# Altium schematic sheet sensor_expansion.SchDoc: Extensibilité capteurs
size A4; DrawnBy: Pierre Dejean / Adam Alves; Revision: V0.1 Rev A; SheetNumber: 3; SheetTotal: 9
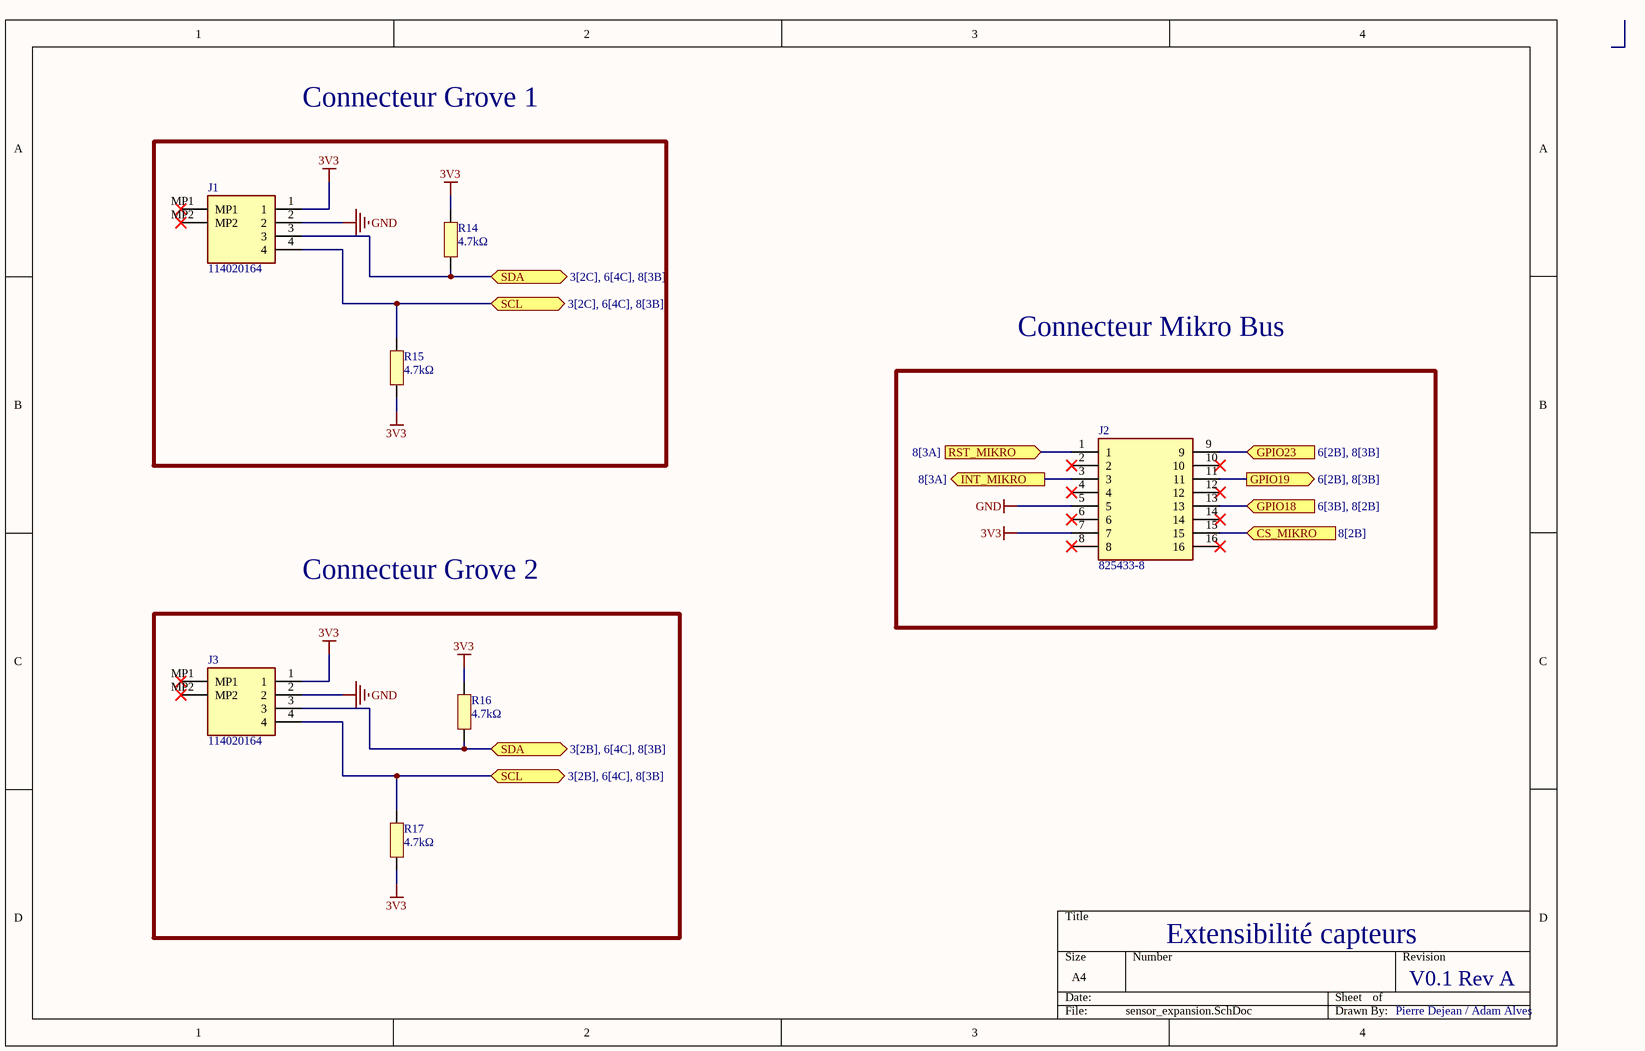
[diagram p0: sensor_expansion.SchDoc]

## Parts
J1  114020164  [114020164]
J2  825433-8  [Connect-Mikrobus]
J3  114020164  [114020164]
R14  4.7kΩ  [RESC1005X06N]
R15  4.7kΩ  [RESC1005X06N]
R16  4.7kΩ  [RESC1005X06N]
R17  4.7kΩ  [RESC1005X06N]

## Ports
CS_MIKRO (in, see 8[2B]), GPIO18 (in, see 6[3B], 8[2B]), GPIO19 (out, see 6[2B], 8[3B]), GPIO23 (in, see 6[2B], 8[3B]), INT_MIKRO (out, see 8[3A]), RST_MIKRO (in, see 8[3A]), SCL (bidir, see 3[2B], 6[4C], 8[3B]), SCL (bidir, see 3[2C], 6[4C], 8[3B]), SDA (bidir, see 3[2B], 6[4C], 8[3B]), SDA (bidir, see 3[2C], 6[4C], 8[3B])

## Nets
3V3: J1.1 J2.7 J3.1 R14.1 R15.1 R16.1 R17.1
GND: J1.2 J2.5 J3.2
CS_MIKRO: J2.15 ; port CS_MIKRO
GPIO18: J2.13 ; port GPIO18
GPIO19: J2.11 ; port GPIO19
GPIO23: J2.9 ; port GPIO23
INT_MIKRO: J2.3 ; port INT_MIKRO
RST_MIKRO: J2.1 ; port RST_MIKRO
SCL: J1.4 J3.4 R15.2 R17.2 ; port SCL
SDA: J1.3 J3.3 R14.2 R16.2 ; port SDA

Not connected (* = marked no-connect by the designer): J1 MP1* MP2*; J2 2* 4* 6* 8* 10* 12* 14* 16*; J3 MP1* MP2*

## Notes on the sheet
- Connecteur Grove 1
- Connecteur Mikro Bus
- Connecteur Grove 2

## Library data of the parts
J1 J3 = 114020164: Seeed Studio Accessories Grove Female Header - SMD-4P-2.0mm-90D-20Pcs; Manufacturer_Name: Seeed Studio; Manufacturer_Part_Number: 114020164; Mouser Part Number: 713-114020164
J2 = Connect-Mikrobus: Headers & Wire Housings 8P double for connection mikrobus; Manufacturer_Name: TE Connectivity; Manufacturer_Part_Number: 825433-8; Mouser Part Number: 571-825433-8
R14-R17 = Resistor